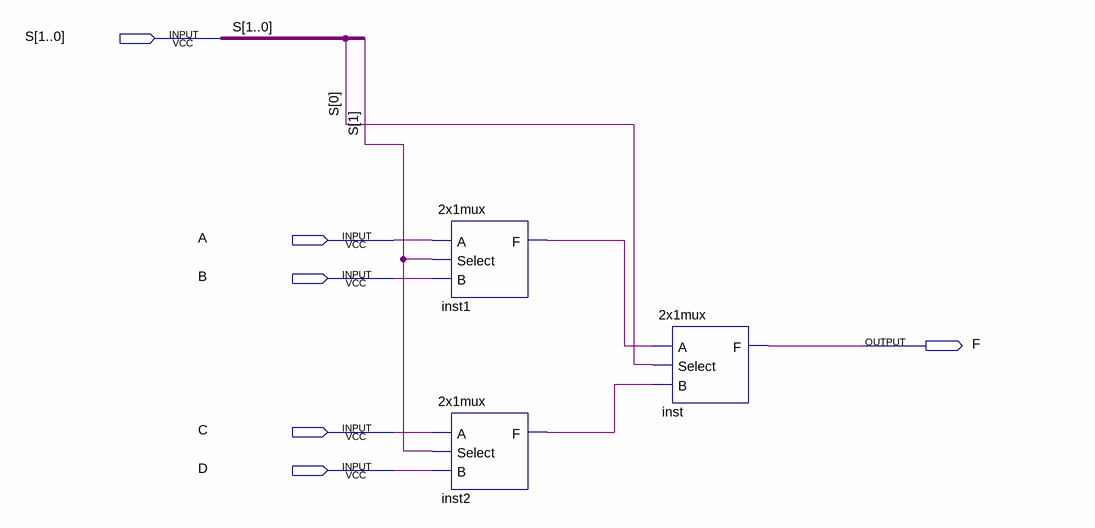
[diagram p0: schematic sheet]
// Quartus schematic 4x1mux.bdf as structural Verilog: 3 symbols, 6 pins
module \4x1mux  (
  input  [1:0] S,
  input  A,
  input  B,
  input  C,
  input  D,
  output F
);

  wire inst1_f, inst2_f;

  \2x1mux  inst1 (.A(A), .Select(S[1]), .B(B), .F(inst1_f));
  \2x1mux  inst2 (.A(C), .Select(S[1]), .B(D), .F(inst2_f));
  \2x1mux  inst (.A(inst1_f), .Select(S[0]), .B(inst2_f), .F(F));
endmodule
